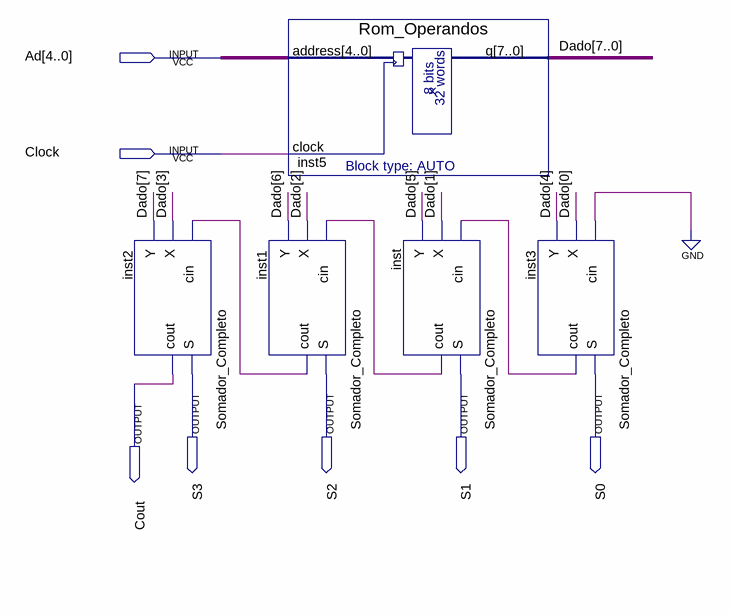
[diagram p0: schematic sheet]
// Quartus schematic Somador_4_Bits.bdf as structural Verilog: 5 symbols, 7 pins
module Somador_4_Bits (
  input  [4:0] Ad,
  input  Clock,
  output S3,
  output S2,
  output S1,
  output S0,
  output Cout
);

  wire inst1_cout, inst3_cout, inst_cout;
  wire [7:0] Dado;

  Somador_Completo inst2 (.cin(inst1_cout), .X(Dado[3]), .Y(Dado[7]), .S(S3), .cout(Cout));
  Rom_Operandos inst5 (.address(Ad), .clock(Clock), .q(Dado));
  Somador_Completo inst1 (.cin(inst_cout), .X(Dado[2]), .Y(Dado[6]), .S(S2), .cout(inst1_cout));
  Somador_Completo inst (.cin(inst3_cout), .X(Dado[1]), .Y(Dado[5]), .S(S1), .cout(inst_cout));
  Somador_Completo inst3 (.cin(1'b0), .X(Dado[0]), .Y(Dado[4]), .S(S0), .cout(inst3_cout));
endmodule
